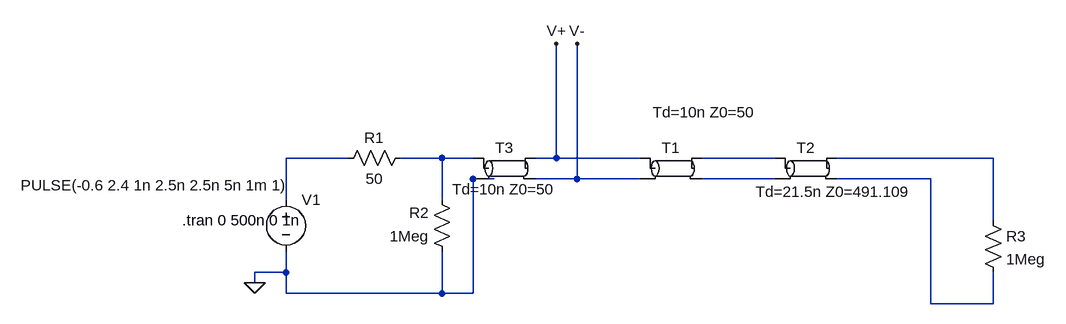
[diagram p0: schematic Draft2.asc]
Draft2.asc, the LTspice schematic file:
Version 4
SHEET 1 952 680
WIRE -128 64 -224 64
WIRE 16 64 -48 64
WIRE 64 64 16 64
WIRE 192 64 192 -112
WIRE 192 64 160 64
WIRE 320 64 192 64
WIRE 528 64 416 64
WIRE 864 64 624 64
WIRE 96 96 64 96
WIRE 224 96 224 -112
WIRE 224 96 160 96
WIRE 320 96 224 96
WIRE 528 96 416 96
WIRE 768 96 624 96
WIRE -224 128 -224 64
WIRE 16 128 16 64
WIRE 864 160 864 64
WIRE -224 240 -224 208
WIRE -224 240 -272 240
WIRE -272 256 -272 240
WIRE -224 272 -224 240
WIRE 16 272 16 208
WIRE 16 272 -224 272
WIRE 64 272 64 96
WIRE 64 272 16 272
WIRE 768 288 768 96
WIRE 864 288 864 240
WIRE 864 288 768 288
FLAG -272 256 0
FLAG 192 -112 V+
FLAG 224 -112 V-
SYMBOL voltage -224 112 R0
WINDOW 3 -408 -6 Left 2
WINDOW 123 0 0 Left 0
WINDOW 39 0 0 Left 0
SYMATTR Value PULSE(-0.6 2.4 1n 2.5n 2.5n 5n 1m 1)
SYMATTR InstName V1
SYMBOL res -32 48 R90
WINDOW 0 0 56 VBottom 2
WINDOW 3 32 56 VTop 2
SYMATTR InstName R1
SYMATTR Value 50
SYMBOL res 32 224 R180
WINDOW 0 36 76 Left 2
WINDOW 3 36 40 Left 2
SYMATTR InstName R2
SYMATTR Value 1Meg
SYMBOL tline 576 80 R0
WINDOW 3 43 20 Top 2
SYMATTR Value Td=21.5n Z0=491.109
SYMATTR InstName T2
SYMBOL res 848 144 R0
SYMATTR InstName R3
SYMATTR Value 1Meg
SYMBOL tline 368 80 R0
WINDOW 3 52 -102 Top 2
SYMATTR Value Td=10n Z0=50
SYMATTR InstName T1
SYMBOL tline 112 80 R0
SYMATTR InstName T3
SYMATTR Value Td=10n Z0=50
TEXT -384 160 Left 2 !.tran 0 500n 0 1n

The netlist it stands for:
* Draft2.asc
V1 N001 0 PULSE(-0.6 2.4 1n 2.5n 2.5n 5n 1m 1)
R1 N002 N001 50
R2 0 N002 1Meg
T2 N003 N005 N004 N006 Td=21.5n Z0=491.109
R3 N004 N006 1Meg
T1 V+ V- N003 N005 Td=10n Z0=50
T3 N002 0 V+ V- Td=10n Z0=50
.tran 0 500n 0 1n
.backanno
.end

* Results of the author's LTspice run, read from the files saved beside the schematic
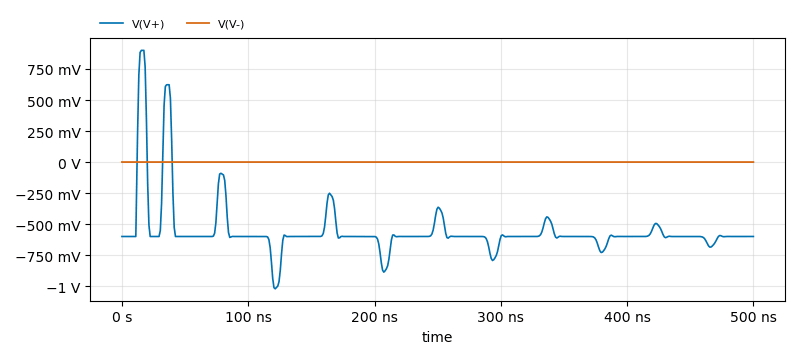
[diagram p1: Transient Analysis of Draft2.asc, plotted from the saved traces]
* Transient Analysis, 1 run:
*   V(V+): min -1.021 V, max 900 mV, average -555.6 mV, rms 603.4 mV, last -599.8 mV
*   V(V-): min -783 nV, max 3.132 µV, average -725 nV, rms 847.8 nV, last -783 nV